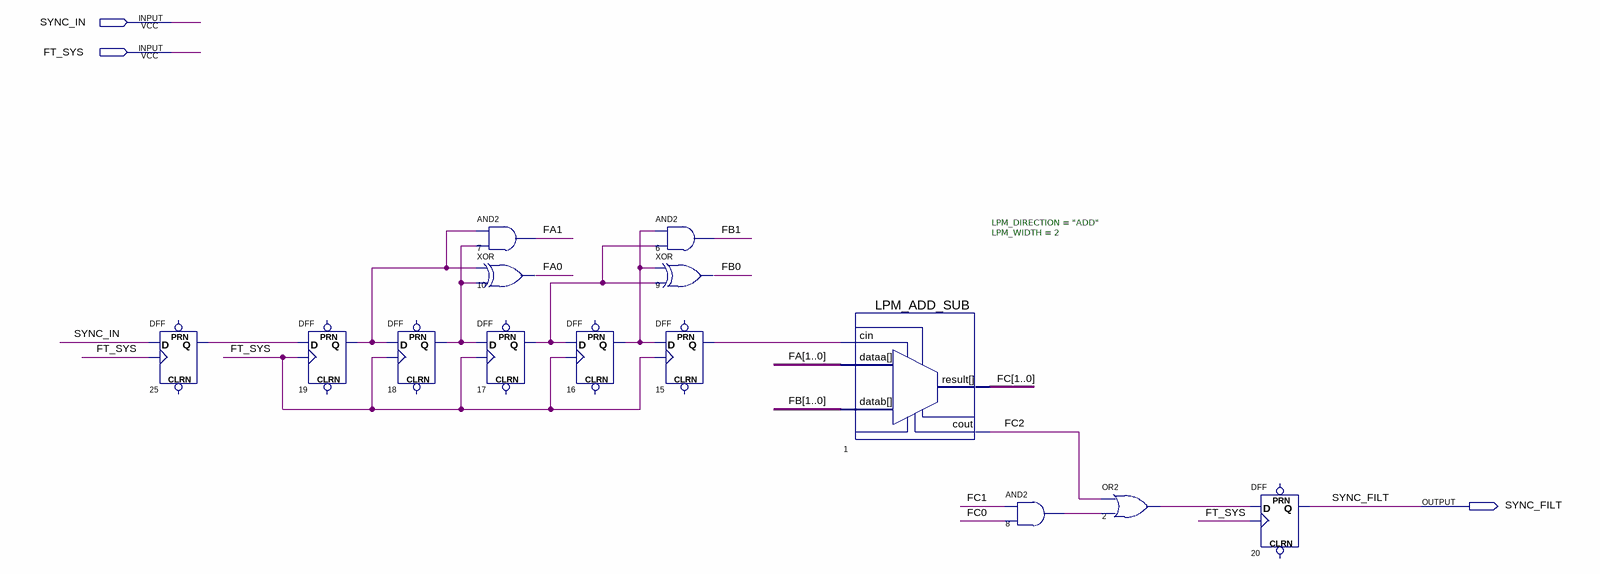
[diagram p0: schematic sheet]
// Quartus schematic m_filter.bdf as structural Verilog: 14 symbols, 3 pins
module m_filter (
  input  SYNC_IN,
  input  FT_SYS,
  output SYNC_FILT
);

  wire FC2, n2_out, n8_out, n15_q, n16_q, n17_q, n18_q, n19_q, n25_q;
  wire [1:0] FA, FB, FC;

  DFF u_25 (.CLK(FT_SYS), .D(SYNC_IN), .Q(n25_q));  // open: CLRN, PRN
  DFF u_19 (.CLK(FT_SYS), .D(n25_q), .Q(n19_q));  // open: CLRN, PRN
  DFF u_18 (.CLK(FT_SYS), .D(n19_q), .Q(n18_q));  // open: CLRN, PRN
  and u_7 (FA[1], n19_q, n18_q);
  xor u_10 (FA[0], n19_q, n18_q);
  DFF u_17 (.CLK(FT_SYS), .D(n18_q), .Q(n17_q));  // open: CLRN, PRN
  DFF u_16 (.CLK(FT_SYS), .D(n17_q), .Q(n16_q));  // open: CLRN, PRN
  and u_6 (FB[1], n16_q, n17_q);
  xor u_9 (FB[0], n16_q, n17_q);
  DFF u_15 (.CLK(FT_SYS), .D(n16_q), .Q(n15_q));  // open: CLRN, PRN
  LPM_ADD_SUB #(.LPM_DIRECTION("ADD"), .LPM_WIDTH(2)) u_1 (
    .datab(FB), .dataa(FA), .cin(n15_q), .cout(FC2), .result(FC));
  and u_8 (n8_out, FC[1], FC[0]);
  or u_2 (n2_out, FC2, n8_out);
  DFF u_20 (.CLK(FT_SYS), .D(n2_out), .Q(SYNC_FILT));  // open: CLRN, PRN
endmodule
